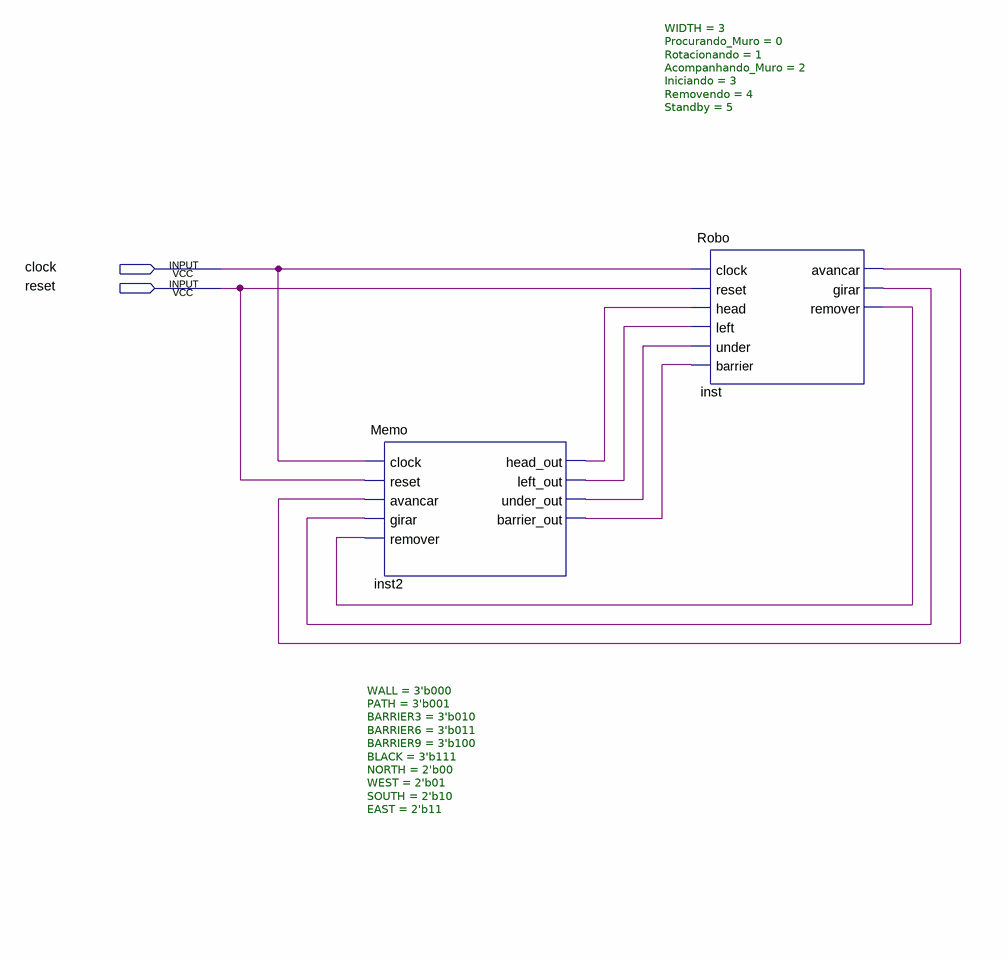
[diagram p0: schematic sheet]
// Quartus schematic top.bdf as structural Verilog: 2 symbols, 2 pins
module top (
  input  clock,
  input  reset
);

  wire inst2_barrier_out, inst2_head_out, inst2_left_out, inst2_under_out, inst_avancar, inst_girar,
       inst_remover;

  Memo #(.WALL(3'b000), .PATH(3'b001), .BARRIER3(3'b010), .BARRIER6(3'b011), .BARRIER9(3'b100), .BLACK(3'b111), .NORTH(2'b00), .WEST(2'b01), .SOUTH(2'b10), .EAST(2'b11)) inst2 (
    .clock(clock), .reset(reset), .avancar(inst_avancar), .girar(inst_girar), .remover(inst_remover),
    .head_out(inst2_head_out), .left_out(inst2_left_out), .under_out(inst2_under_out),
    .barrier_out(inst2_barrier_out));
  Robo #(.WIDTH(3), .Procurando_Muro(0), .Rotacionando(1), .Acompanhando_Muro(2), .Iniciando(3), .Removendo(4), .Standby(5)) inst (
    .clock(clock), .reset(reset), .head(inst2_head_out), .left(inst2_left_out), .under(inst2_under_out),
    .barrier(inst2_barrier_out), .avancar(inst_avancar), .girar(inst_girar), .remover(inst_remover));
endmodule
